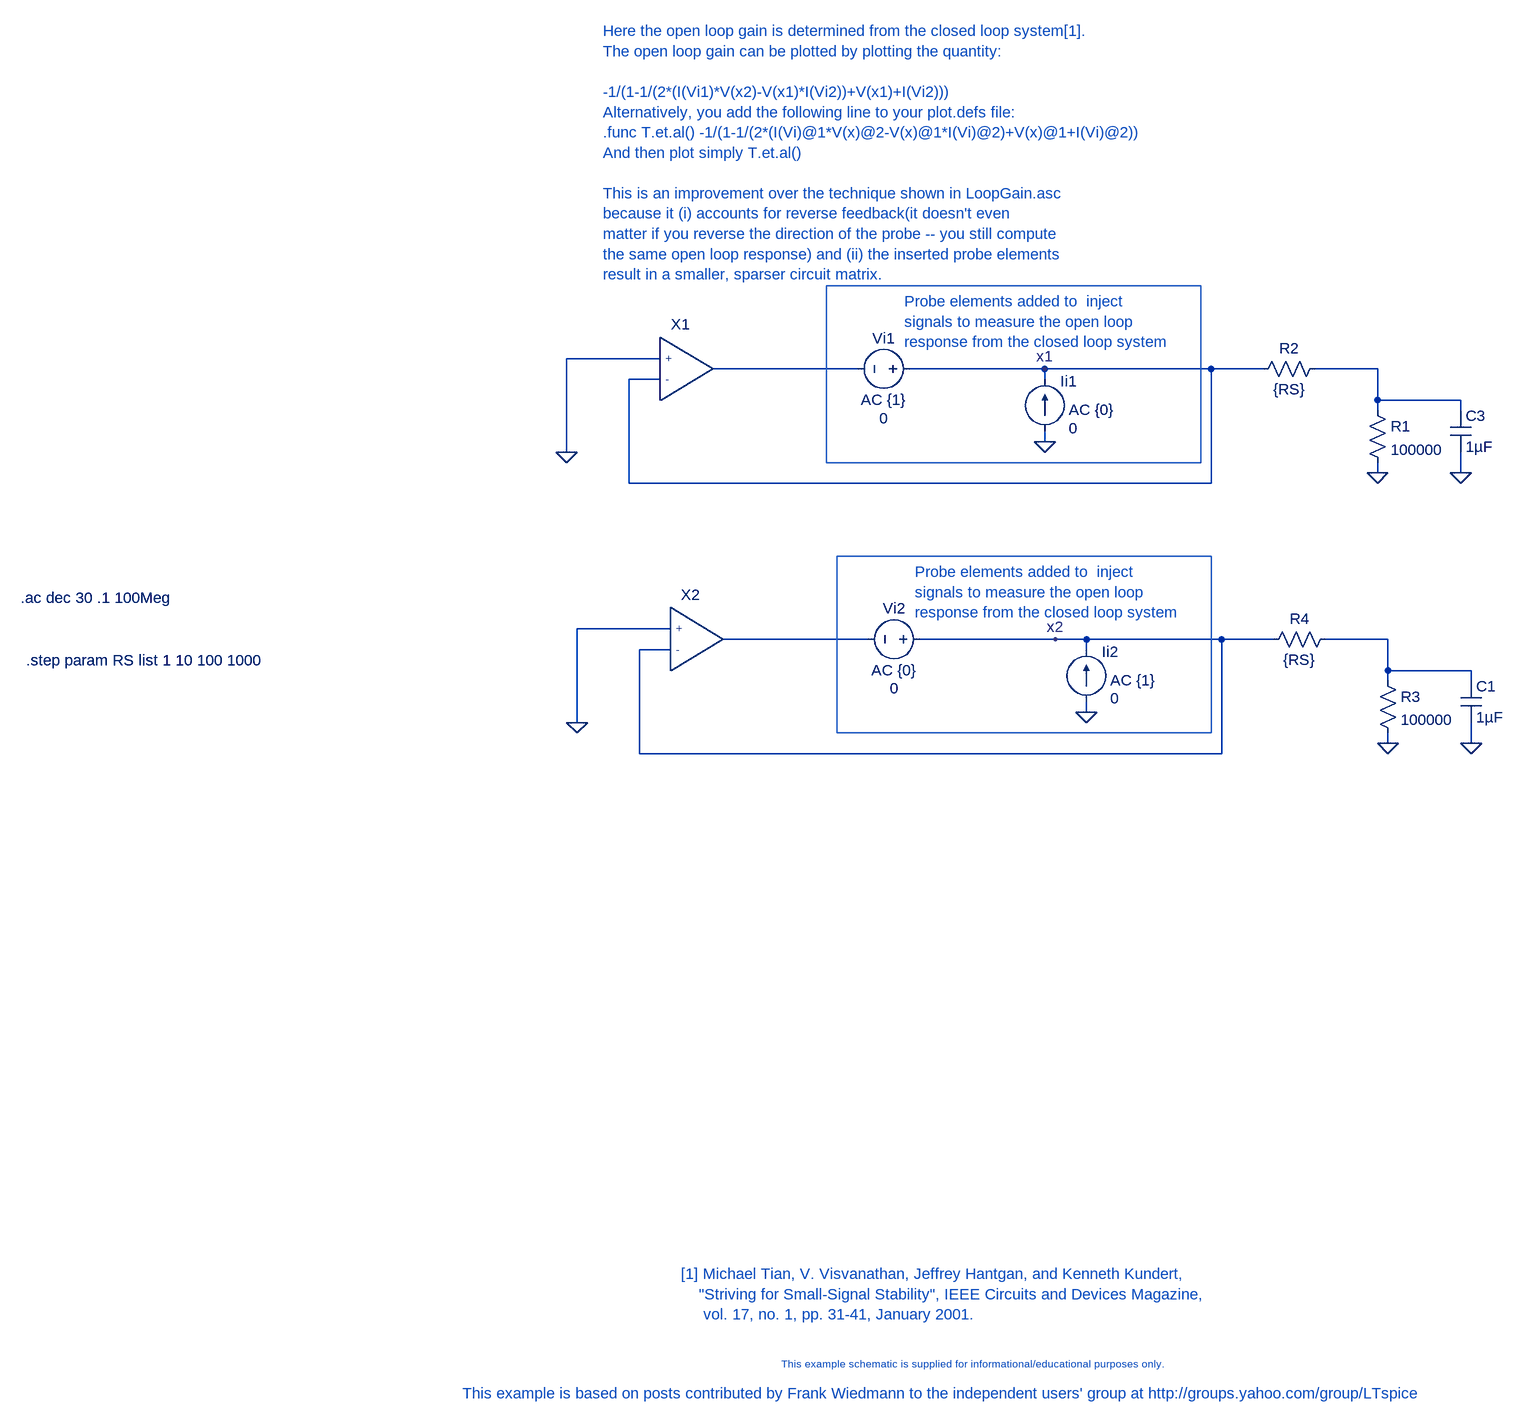
[diagram p0: schematic follower stability and transfer func00.asc]
follower stability and transfer func00.asc, the LTspice schematic file:
Version 4
SHEET 1 1764 1656
WIRE -1744 48 -1888 48
WIRE -1440 64 -1664 64
WIRE -1152 64 -1360 64
WIRE -896 64 -1152 64
WIRE -816 64 -896 64
WIRE -640 64 -736 64
WIRE -1744 80 -1792 80
WIRE -1152 80 -1152 64
WIRE -640 112 -640 64
WIRE -512 112 -640 112
WIRE -640 128 -640 112
WIRE -512 128 -512 112
WIRE -1152 176 -1152 160
WIRE -1888 192 -1888 48
WIRE -640 224 -640 208
WIRE -512 224 -512 192
WIRE -1792 240 -1792 80
WIRE -896 240 -896 64
WIRE -896 240 -1792 240
WIRE -1728 464 -1872 464
WIRE -1424 480 -1648 480
WIRE -1136 480 -1344 480
WIRE -1088 480 -1136 480
WIRE -880 480 -1088 480
WIRE -800 480 -880 480
WIRE -624 480 -720 480
WIRE -1728 496 -1776 496
WIRE -1088 496 -1088 480
WIRE -624 528 -624 480
WIRE -496 528 -624 528
WIRE -624 544 -624 528
WIRE -496 544 -496 528
WIRE -1088 592 -1088 576
WIRE -1872 608 -1872 464
WIRE -624 640 -624 624
WIRE -496 640 -496 608
WIRE -1776 656 -1776 496
WIRE -880 656 -880 480
WIRE -880 656 -1776 656
FLAG -1888 192 0
FLAG -640 224 0
FLAG -1152 176 0
FLAG -1152 64 x1
FLAG -512 224 0
FLAG -1872 608 0
FLAG -624 640 0
FLAG -1136 480 x2
FLAG -496 640 0
FLAG -1088 592 0
SYMBOL behavioral_opamp_subcircuit -1712 64 R0
SYMATTR InstName X1
SYMBOL res -656 112 R0
SYMATTR InstName R1
SYMATTR Value 100000
SYMBOL current -1152 160 M180
WINDOW 0 24 77 Left 2
WINDOW 3 37 5 Left 2
WINDOW 123 37 33 Left 2
WINDOW 39 0 0 Left 2
SYMATTR InstName Ii1
SYMATTR Value 0
SYMATTR Value2 AC {0}
SYMBOL voltage -1344 64 M270
WINDOW 0 32 56 VTop 2
WINDOW 3 -60 56 VBottom 2
WINDOW 123 -32 56 VBottom 2
WINDOW 39 -32 56 VBottom 2
SYMATTR InstName Vi1
SYMATTR Value 0
SYMATTR Value2 AC {1}
SYMBOL cap -528 128 R0
SYMATTR InstName C3
SYMATTR Value 1µF
SYMBOL res -720 48 R90
WINDOW 0 0 56 VBottom 2
WINDOW 3 32 56 VTop 2
SYMATTR InstName R2
SYMATTR Value {RS}
SYMBOL behavioral_opamp_subcircuit -1696 480 R0
SYMATTR InstName X2
SYMBOL res -640 528 R0
SYMATTR InstName R3
SYMATTR Value 100000
SYMBOL voltage -1328 480 M270
WINDOW 0 32 56 VTop 2
WINDOW 3 -60 56 VBottom 2
WINDOW 123 -32 56 VBottom 2
WINDOW 39 -32 56 VBottom 2
SYMATTR InstName Vi2
SYMATTR Value 0
SYMATTR Value2 AC {0}
SYMBOL cap -512 544 R0
SYMATTR InstName C1
SYMATTR Value 1µF
SYMBOL res -704 464 R90
WINDOW 0 0 56 VBottom 2
WINDOW 3 32 56 VTop 2
SYMATTR InstName R4
SYMATTR Value {RS}
SYMBOL current -1088 576 M180
WINDOW 0 24 77 Left 2
WINDOW 3 37 5 Left 2
WINDOW 123 37 33 Left 2
WINDOW 39 0 0 Left 2
SYMATTR InstName Ii2
SYMATTR Value 0
SYMATTR Value2 AC {1}
TEXT -2728 416 Left 2 !.ac dec 30 .1 100Meg
TEXT -1832 -456 Left 2 ;Here the open loop gain is determined from the closed loop system[1].\nThe open loop gain can be plotted by plotting the quantity:\n \n-1/(1-1/(2*(I(Vi1)*V(x2)-V(x1)*I(Vi2))+V(x1)+I(Vi2)))\nAlternatively, you add the following line to your plot.defs file:\n.func T.et.al() -1/(1-1/(2*(I(Vi)@1*V(x)@2-V(x)@1*I(Vi)@2)+V(x)@1+I(Vi)@2))\nAnd then plot simply T.et.al()\n \nThis is an improvement over the technique shown in LoopGain.asc \nbecause it (i) accounts for reverse feedback(it doesn't even\nmatter if you reverse the direction of the probe -- you still compute\nthe same open loop response) and (ii) the inserted probe elements\nresult in a smaller, sparser circuit matrix.
TEXT -1272 1584 Top 1 ;This example schematic is supplied for informational/educational purposes only.
TEXT -1712 1456 Left 2 ;[1] Michael Tian, V. Visvanathan, Jeffrey Hantgan, and Kenneth Kundert,\n    "Striving for Small-Signal Stability", IEEE Circuits and Devices Magazine,\n     vol. 17, no. 1, pp. 31-41, January 2001.
TEXT -1368 -40 Left 2 ;Probe elements added to  inject\nsignals to measure the open loop\nresponse from the closed loop system
TEXT -2048 1640 Left 2 ;This example is based on posts contributed by Frank Wiedmann to the independent users' group at http://groups.yahoo.com/group/LTspice
TEXT -2720 512 Left 2 !.step param RS list 1 10 100 1000
TEXT -1352 376 Left 2 ;Probe elements added to  inject\nsignals to measure the open loop\nresponse from the closed loop system
RECTANGLE Normal -912 208 -1488 -64
RECTANGLE Normal -896 624 -1472 352

The netlist it stands for:
* follower stability and transfer func00.asc
XX1 0 x1 N001 behavioral_opamp_subcircuit  ; pins + - out
R1 N002 0 100000
Ii1 0 x1 0 AC {0}
Vi1 x1 N001 0 AC {1}
C3 N002 0 1µF
R2 N002 x1 {RS}
XX2 0 x2 N003 behavioral_opamp_subcircuit  ; pins + - out
R3 N004 0 100000
Vi2 x2 N003 0 AC {0}
C1 N004 0 1µF
R4 N004 x2 {RS}
Ii2 0 x2 0 AC {1}
.ac dec 30 .1 100Meg
* Here the open loop gain is determined from the closed loop system[1].
* The open loop gain can be plotted by plotting the quantity:
* -1/(1-1/(2*(I(Vi1)*V(x2)-V(x1)*I(Vi2))+V(x1)+I(Vi2)))
* Alternatively, you add the following line to your plot.defs file:
* .func T.et.al() -1/(1-1/(2*(I(Vi)@1*V(x)@2-V(x)@1*I(Vi)@2)+V(x)@1+I(Vi)@2))
* And then plot simply T.et.al()
* This is an improvement over the technique shown in LoopGain.asc
* because it (i) accounts for reverse feedback(it doesn't even
* matter if you reverse the direction of the probe -- you still compute
* the same open loop response) and (ii) the inserted probe elements
* result in a smaller, sparser circuit matrix.
* This example schematic is supplied for informational/educational purposes only.
* [1] Michael Tian, V. Visvanathan, Jeffrey Hantgan, and Kenneth Kundert,
*     "Striving for Small-Signal Stability", IEEE Circuits and Devices Magazine,
*      vol. 17, no. 1, pp. 31-41, January 2001.
* Probe elements added to  inject
* signals to measure the open loop
* response from the closed loop system
* This example is based on posts contributed by Frank Wiedmann to the independent users' group at http://groups.yahoo.com/group/LTspice
.step param RS list 1 10 100 1000
* Probe elements added to  inject
* signals to measure the open loop
* response from the closed loop system
.backanno
.end